# EAGLE design sumorobot (EAGLE 5.12)
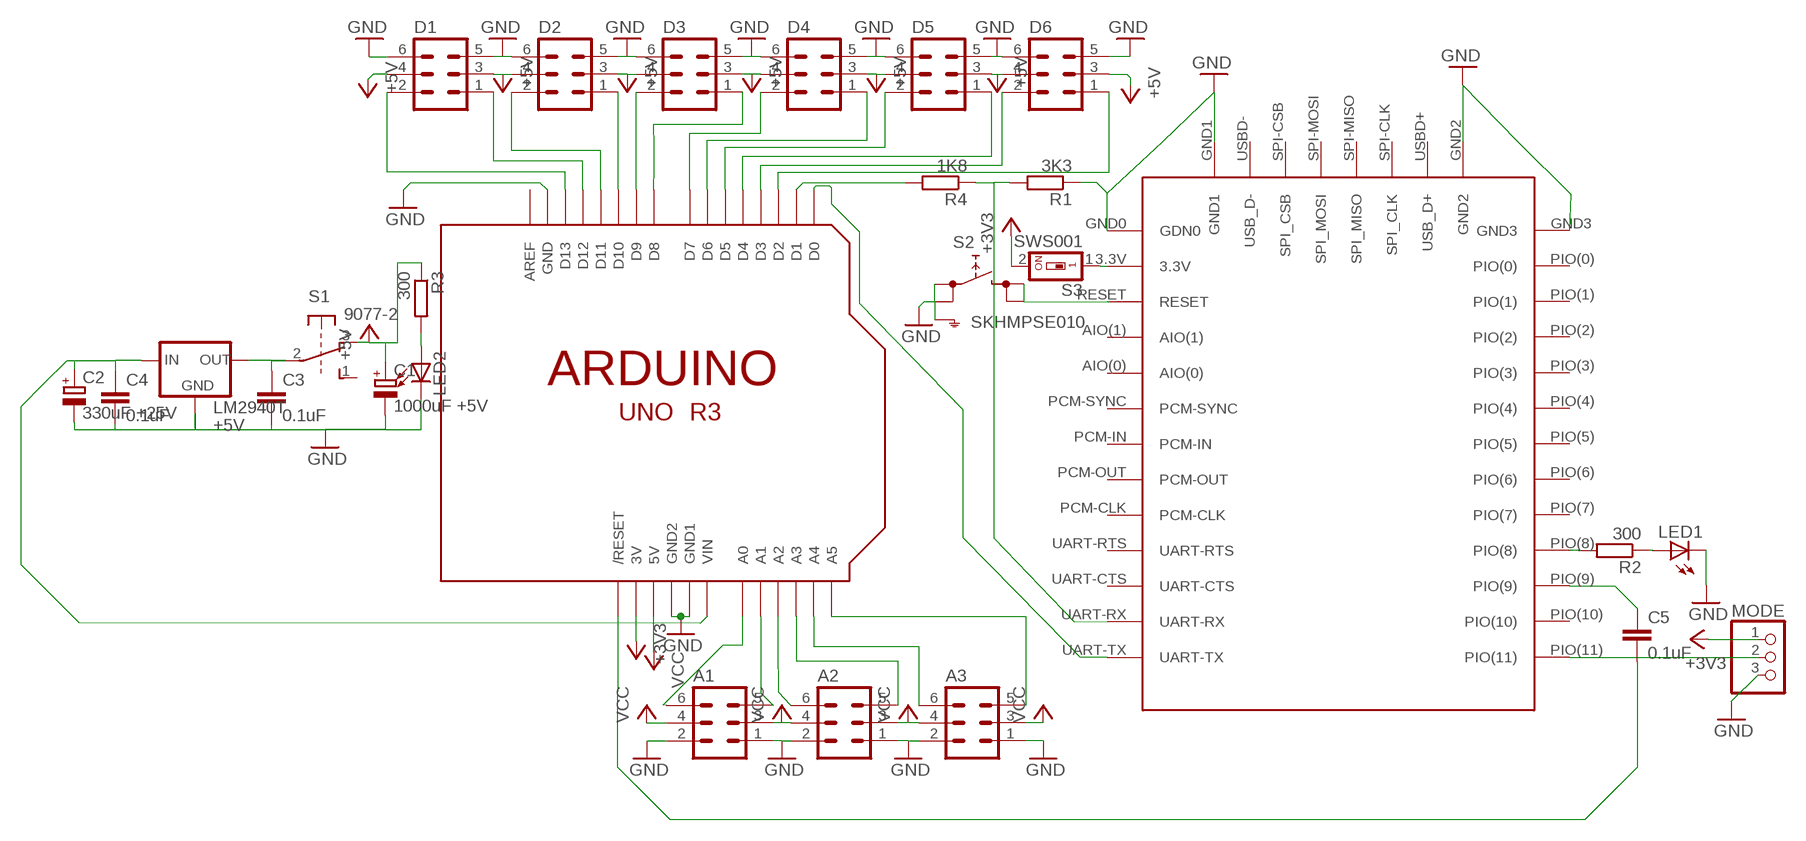
[diagram p0: schematic, sheet 1]

## Parts
A1  MA03-2  [MA03-2]
A2  MA03-2  [MA03-2]
A3  MA03-2  [MA03-2]
C1  1000uF +5V  CPOL-EUE5-10.5  [E5-10,5]
C2  330uF +25V  CPOL-EUE5-10.5  [E5-10,5]
C3  0.1uF  C-EUC1206  [C1206]
C4  0.1uF  C-EUC1206  [C1206]
C5  0.1uF  C-EUC1206  [C1206]
D1  MA03-2  [MA03-2]
D2  MA03-2  [MA03-2]
D3  MA03-2  [MA03-2]
D4  MA03-2  [MA03-2]
D5  MA03-2  [MA03-2]
D6  MA03-2  [MA03-2]
LED1  LEDSML1206  [SML1206]
LED2  LED3MM  [LED3MM]
LM2940T  +5V  78XXL  [78XXL]
MODE  PINHD-1X3  [1X03]
MODULE  SKU_80711  [SKU_80711]
R1  3K3  R-EU_R1206  [R1206]
R2  300  R-EU_R1206  [R1206]
R3  300  R-EU_R1206  [R1206]
R4  1K8  R-EU_R1206  [R1206]
S1  9077-2  [9077-2]
S2  SKHMPSE010  [SKHMPXE010]
S3  SWS001  [SMS-001]
U$1  ARDUINO-NOHOLE  [ARDUINO-NOHOLE]

## Nets
+3V3: MODE.1 S3.2 U$1.3V
+5V: C1.+ D1.3 D1.4 D2.3 D2.4 D3.3 D3.4 D4.3 D4.4 D5.3 D5.4 D6.3 D6.4 R3.1 S1.3(1:O)
D4: D4.1 U$1.D6
GND: A1.1 A1.2 A2.1 A2.2 A3.1 A3.2 C1.- C2.- C3.2 C4.2 D1.5 D1.6 D2.5 D2.6 D3.5 D3.6 D4.5 D4.6 D5.5 D5.6 D6.5 D6.6 LED1.C LED2.K(C) LM2940T.GND MODE.3 MODULE.GND0(GDN0) MODULE.GND1 MODULE.GND2 MODULE.GND3 R1.1 S2.1(1.1) S2.2(1.2) S2.5(SH) U$1.GND U$1.GND1 U$1.GND2
N$1: MODULE.UART-TX U$1.D0
N$2: A3.6 U$1.A4
N$3: LED2.A R3.2
N$4: C5.1 MODULE.PIO(9)
N$5: R4.2 U$1.D1
N$6: A3.5 U$1.A5
N$7: MODULE.RESET S2.3(2.1) S2.4(2.2)
N$8: A1.6 U$1.A0
N$9: A1.5 U$1.A1
N$10: MODULE.PIO(8) R2.2
N$11: D5.1 U$1.D4
N$12: D6.2 U$1.D3
N$13: D6.1 U$1.D2
N$14: MODULE.UART-RX R1.2 R4.1
N$15: LED1.A R2.1
N$16: C5.2 U$1.RESET(/RESET)
N$17: C3.1 LM2940T.OUT S1.2(1:P)
N$18: MODE.2 MODULE.PIO(11)
N$19: MODULE.3.3V S3.1
N$20: C2.+ C4.1 LM2940T.IN U$1.VIN
N$27: D1.2 U$1.D13
N$28: D1.1 U$1.D12
N$29: D2.2 U$1.D11
N$30: D2.1 U$1.D10
N$31: D3.2 U$1.D9
N$32: D3.1 U$1.D8
N$33: D4.2 U$1.D7
N$34: A2.6 U$1.A2
N$35: D5.2 U$1.D5
N$37: A2.5 U$1.A3
VCC: A1.3 A1.4 A2.3 A2.4 A3.3 A3.4 U$1.5V
Unconnected: MODULE.AIO(0) MODULE.AIO(1) MODULE.PCM-CLK MODULE.PCM-IN MODULE.PCM-OUT MODULE.PCM-SYNC MODULE.PIO(0) MODULE.PIO(1) MODULE.PIO(2) MODULE.PIO(3) MODULE.PIO(4) MODULE.PIO(5) MODULE.PIO(6) MODULE.PIO(7) MODULE.PIO(10) MODULE.SPI-CLK(SPI_CLK) MODULE.SPI-CSB(SPI_CSB) MODULE.SPI-MISO(SPI_MISO) MODULE.SPI-MOSI(SPI_MOSI) MODULE.UART-CTS MODULE.UART-RTS MODULE.USBD+(USB_D+) MODULE.USBD-(USB_D-) S1.1(1:S) S1.4(2:S) S1.5(2:P) S1.6(2:O) U$1.AREF

## Library data of the parts
A1-A3 D1-D6 = con-lstb:MA03-2: PIN HEADER; OC_FARNELL: unknown; OC_NEWARK: unknown
C1 C2 = rcl:CPOL-EU: POLARIZED CAPACITOR, European symbol
C3-C5 = rcl:C-EU: CAPACITOR, European symbol
LED1 LED2 = led:LED: LED OSRAM: - CHIPLED LG R971, LG N971, LY N971, LG Q971, LY Q971, LO R971, LY R971 LH N974, LH R974 LS Q976, LO Q976, LY Q976 LO Q996 - Hyper CHIPLED LW Q18S LB Q993, LB Q99A, LB R99A - SideLED LS A670, LO A670, LY A670, LG A670, LP A670 LB A673, LV A673, LT A673, LW A673 LH A674 LY A675 LS A676, LA A676, LO A676, LY A676, LW A676 LS A679, LY A679, LG A679 - Hyper Micro SIDELED® LS Y876, LA Y876, LO Y876, LY Y876 LT Y87S - SmartLED LW L88C, LW L88S LB L89C, LB L89S, LG L890 LS L89K, LO L89K, LY L89K LS L896, LA L896, LO L896, LY L896 - TOPLED LS T670, LO T670, LY T670, LG T670, LP T670 LSG T670, LSP T670, LSY T670, LOP T670, LYG T670 LG T671, LOG T671, LSG T671 LB T673, LV T673, LT T673, LW T673 LH T674 LS T676, LA T676, LO T676, LY T676, LB T676, LH T676, LSB T676, LW T676 LB T67C, LV T67C, LT T67C, LS T67K, LO T67K, LY T67K, LW E67C LS E67B, LA E67B, LO E67B, LY E67B, LB E67C, LV E67C, LT E67C LW T67C LS T679, LY T679, LG T679 LS T770, LO T770, LY T770, LG T770, LP T770 LB T773, LV T773, LT T773, LW T773 LH T774 LS E675, LA E675, LY E675, LS T675 LS T776, LA T776, LO T776, LY T776, LB T776 LHGB T686 LT T68C, LB T68C - Hyper Mini TOPLED® LB M676 - Mini TOPLED Santana® LG M470 LS M47K, LO M47K, LY M47K Source: http://www.osram.convergy.de LUXEON: - LUMILED® LXK2-PW12-R00, LXK2-PW12-S00, LXK2-PW14-U00, LXK2-PW14-V00 LXK2-PM12-R00, LXK2-PM12-S00, LXK2-PM14-U00 LXK2-PE12-Q00, LXK2-PE12-R00, LXK2-PE12-S00, LXK2-PE14-T00, LXK2-PE14-U00 LXK2-PB12-K00, LXK2-PB12-L00, LXK2-PB12-M00, LXK2-PB14-N00, LXK2-PB14-P00, LXK2-PB14-Q00 LXK2-PR12-L00, LXK2-PR12-M00, LXK2-PR14-Q00, LXK2-PR14-R00 LXK2-PD12-Q00, LXK2-PD12-R00, LXK2-PD12-S00 LXK2-PH12-R00, LXK2-PH12-S00 LXK2-PL12-P00, LXK2-PL12-Q00, LXK2-PL12-R00 Source: www.luxeon.com KINGBRIGHT: KA-3528ASYC Source: www.kingbright.com
LM2940T = v-reg:78XXL: VOLTAGE REGULATOR
MODE = pinhead:PINHD-1X3: PIN HEADER
MODULE = Bluetooth_serial:SKU_80711
R1-R4 = rcl:R-EU_: RESISTOR, European symbol
S1 = switch-misc:9077-2: MARQUARDT SWITCH 9077.0200 Distributor: Buerklin <https://www.buerklin.com/default.asp?event=ShowArtikel%2812G2822%29&l=d&jump=ArtNr_12G2822>
S2 = switch:SKHMP*E010: 6.2 X 6.5mm TACT Switch (SMD) Source: http://www3.alps.co.jp/WebObjects/catalog.woa/PDF/E/Switch/Tact/SKHM/SKHM.PDF
S3 = smd-special:SWS001: SMD Dip Switch 1 pol.
U$1 = arduino_uno:ARDUINO: Arduino Diecimila/Duemilanove Make a shield with ease, this package has all the named pins as well as the two mounting drill holes and an outline of the USB and DC power connector. The outline is on the DIMENSION layer, so if your board house uses it they will cut the outline to match. http://www.ladyada.net/library/pcb/eaglelibrary.html

## Board
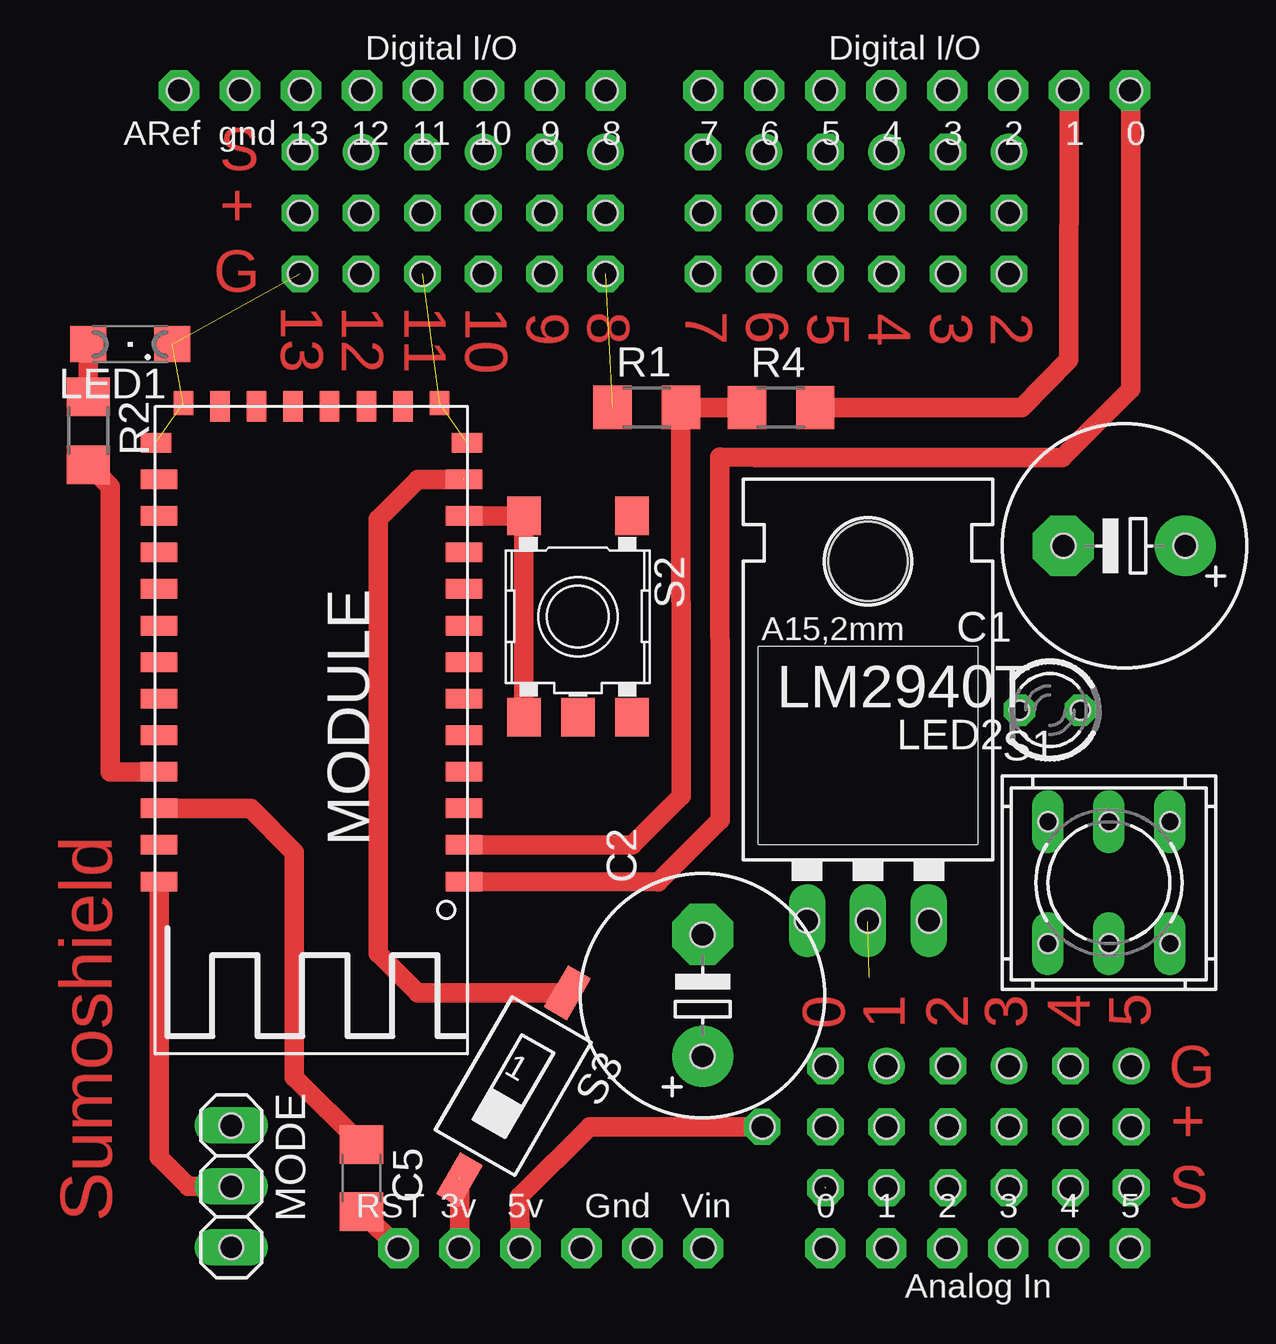
[diagram p1: board, top side]
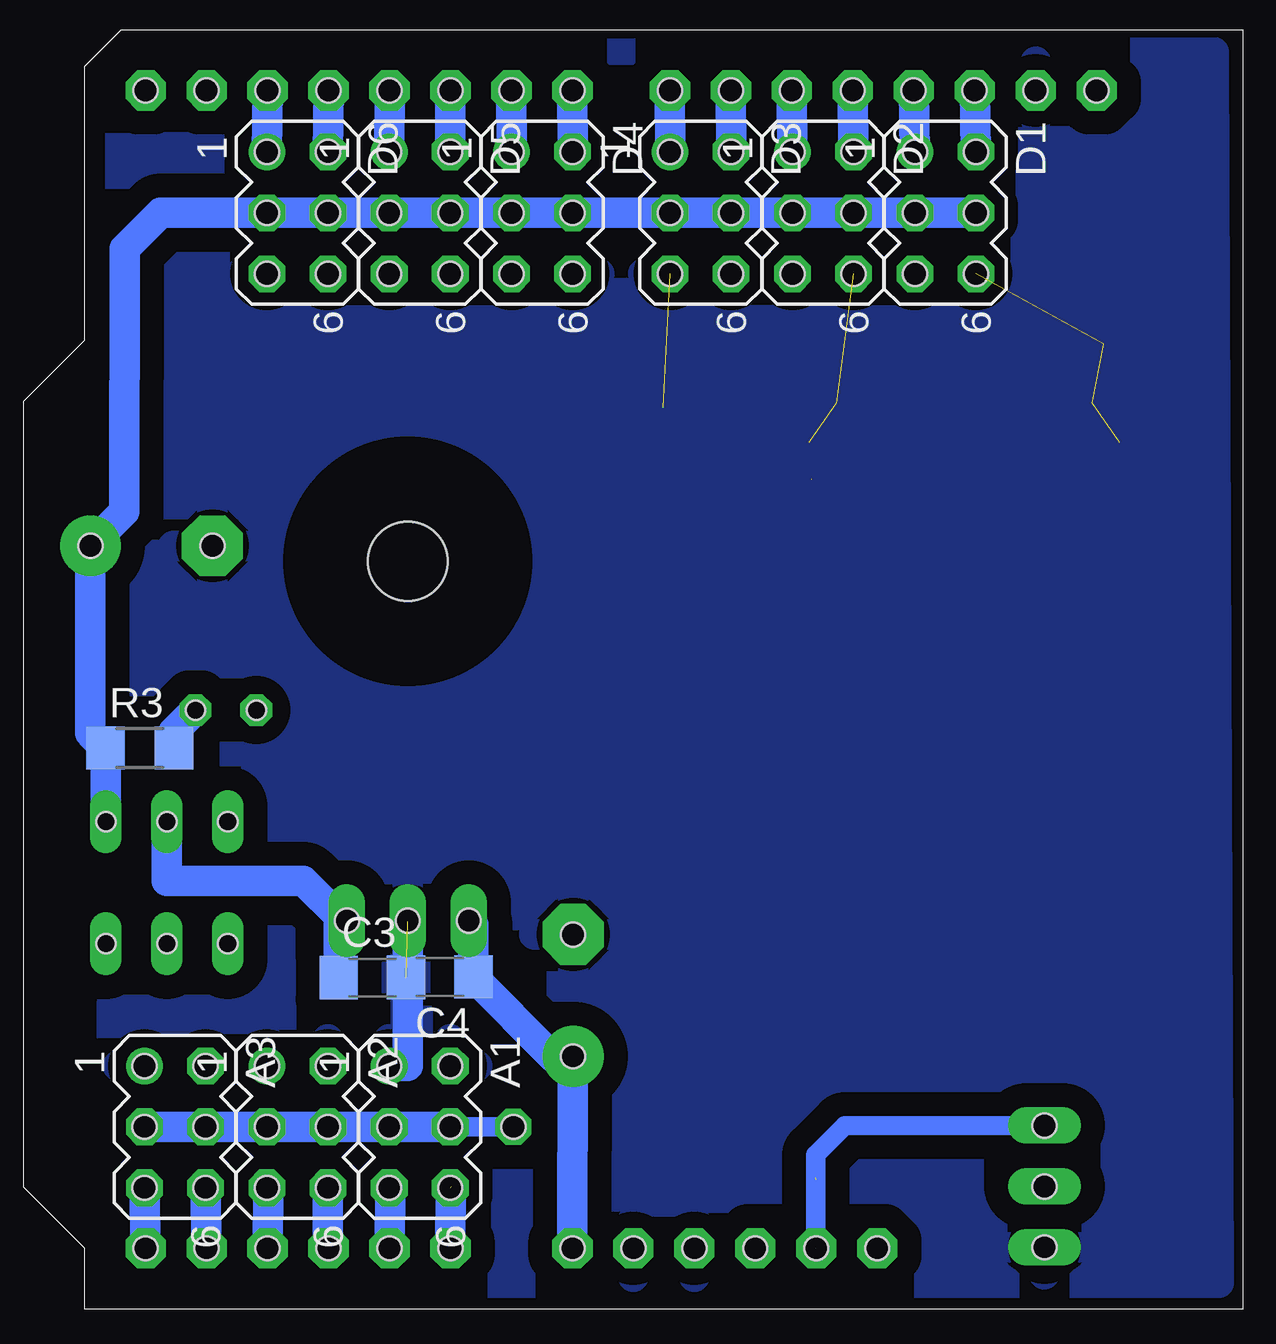
[diagram p2: board, bottom side, seen from below]

No outline drawn. Coordinates in mm, seen from the top.
Copper layers (1*16): Top 0.035mm / dielectric 1.5mm / Bottom 0.035mm
Design rules "default": minimum track width 10mil, minimum drill 24mil, track to track 8mil, track to pad 8mil, pad to pad 8mil, via to via 8mil, smd to smd 8mil, copper to edge 40mil, drill to drill 8mil, minimum pad ring 10mil, minimum via ring 8mil, stop-mask expansion 4mil, vias tented up to drill 0mil, thermal gap 10mil
Holes 1 mm at 6.1,50.8 34.8,16.19 30.4,7.6 8.27,5.12 8.27,7.66 8.27,2.58 8.64,50.8 11.18,50.8 13.72,50.8 16.26,50.8 18.8,50.8 21.34,50.8 23.87,50.8 27.94,50.8 30.48,50.8 33.02,50.8 35.56,50.8 38.1,50.8 40.64,50.8 43.18,50.8 45.72,50.8 40.67,48.24 38.13,48.24 35.57,48.24 33.03,48.24 30.47,48.24 27.93,48.24 23.87,48.24 21.33,48.24 18.77,48.24 16.23,48.24 13.67,48.24 11.13,48.24 11.13,45.7 13.67,45.7 16.23,45.7 18.77,45.7 21.33,45.7 23.87,45.7 11.13,43.16 13.67,43.16 16.23,43.16 18.77,43.16 21.33,43.16 23.87,43.16 27.93,45.7 30.47,45.7 33.03,45.7 35.57,45.7 38.13,45.7 40.67,45.7 40.67,43.16 38.13,43.16 35.57,43.16 33.03,43.16 30.47,43.16 27.93,43.16 48.02,31.82 42.94,31.82 27.91,10.54 27.91,15.62 32.26,16.19 37.34,16.19 15.24,2.54 17.78,2.54 20.32,2.54 25.4,2.54 22.86,2.54 27.94,2.54 33.02,2.54 35.56,2.54 38.1,2.54 40.64,2.54 43.18,2.54 45.72,2.54 45.77,5.06 43.23,5.06 40.67,5.06 38.13,5.06 35.57,5.06 33.03,5.06 33.03,7.6 35.57,7.6 38.13,7.6 40.67,7.6 43.23,7.6 45.77,7.6 45.77,10.14 43.23,10.14 40.67,10.14 38.13,10.14 35.57,10.14 33.03,10.14
Holes 0.8 mm at 44.84,15.24 42.3,15.24 47.38,15.24 47.38,20.32 44.84,20.32 42.3,20.32 41.11,24.97 43.65,24.97

### Footprints (pad centres in the part's own frame; a part is rotated, then mirrored left to right if it is on the bottom)
MA03-2 = drill 1.016 round: 1 -2.54,-1.27 | drill 1.016 octagon: 2 -2.54,1.27; 3 0,-1.27; 4 0,1.27; 5 2.54,-1.27; 6 2.54,1.27
E5-10,5 = drill 1.016 pad 2.54 round: + -2.54,0 | drill 1.016 pad 2.54 octagon: - 2.54,0
C1206 = smd 1.6 x 1.8: 1 -1.4,0; 2 1.4,0
SML1206 = smd 1.5 x 1.5: A 1.75,0; C -1.75,0
LED3MM = drill 0.813 octagon: A -1.27,0; K 1.27,0
78XXL = drill 1.016 long: GND 0,-3.81; IN -2.54,-3.81; OUT 2.54,-3.81 | hole 3.302: 0,11.176
1X03 = drill 1.016 long: 1 -2.54,0; 2 0,0; 3 2.54,0
SKU_80711 = smd 1.524 x 0.813: 3.3V -6.35,3.048; AIO(0) -6.35,7.62; AIO(1) -6.35,6.096; PCM-CLK -6.35,13.716; PCM-IN -6.35,10.668; PCM-OUT -6.35,12.192; PCM-SYNC -6.35,9.144; PIO(0) 6.35,3.048; PIO(1) 6.35,4.572; PIO(2) 6.35,6.096; PIO(3) 6.35,7.62; PIO(4) 6.35,9.144; PIO(5) 6.35,10.668; PIO(6) 6.35,12.192; PIO(7) 6.35,13.716; PIO(8) 6.35,15.24; PIO(9) 6.35,16.764; PIO(10) 6.35,18.288; PIO(11) 6.35,19.812; RESET -6.35,4.572; UART-CTS -6.35,16.764; UART-RTS -6.35,15.24; UART-RX -6.35,18.288; UART-TX -6.35,19.812 | smd 1.27 x 0.813: GND0 -6.477,1.524; GND3 6.477,1.524 | smd 0.813 x 1.016: GND1 -5.334,-0.127; GND2 5.334,-0.127 | smd 0.813 x 1.27: SPI-CLK 2.286,0; SPI-CSB -2.286,0; SPI-MISO 0.762,0; SPI-MOSI -0.762,0; USBD+ 3.81,0; USBD- -3.81,0
R1206 = smd 1.6 x 1.803: 1 -1.422,0; 2 1.422,0
9077-2 = drill 0.813 long: 1 -2.54,2.54; 2 0,2.54; 3 2.54,2.54; 4 -2.54,-2.54; 5 0,-2.54; 6 2.54,-2.54
SKHMPXE010 = smd 1.6 x 1.4: 1 -4.2,2.25; 2 4.2,2.25; 3 -4.2,-2.25; 4 4.2,-2.25; 5 4.2,0
SMS-001 = smd 1.092 x 2.007: 1 0,-4.496; 2 0,4.496
ARDUINO-NOHOLE = drill 1 pad 1.676 octagon: 3V 17.78,2.54; 5V 20.32,2.54; A0 33.02,2.54; A1 35.56,2.54; A2 38.1,2.54; A3 40.64,2.54; A4 43.18,2.54; A5 45.72,2.54; AREF 6.096,50.8; D0 45.72,50.8; D1 43.18,50.8; D2 40.64,50.8; D3 38.1,50.8; D4 35.56,50.8; D5 33.02,50.8; D6 30.48,50.8; D7 27.94,50.8; D8 23.876,50.8; D9 21.336,50.8; D10 18.796,50.8; D11 16.256,50.8; D12 13.716,50.8; D13 11.176,50.8; GND 8.636,50.8; GND1 25.4,2.54; GND2 22.86,2.54; RESET 15.24,2.54; VIN 27.94,2.54

### Placement (x,y rotation side)
A1  34.3,7.6 270 bottom
A2  39.4,7.6 270 bottom
A3  44.5,7.6 270 bottom
C1  45.48,31.82 180 top
C2  27.91,13.08 90 top
C3  36.27,13.82 0 bottom
C4  33.46,13.85 180 bottom
C5  13.7,5.47 270 top
D1  12.4,45.7 270 bottom
D2  17.5,45.7 270 bottom
D3  22.6,45.7 270 bottom
D4  29.2,45.7 270 bottom
D5  34.3,45.7 270 bottom
D6  39.4,45.7 270 bottom
LED1  4.06,40.22 180 top
LED2  42.38,24.97 180 top
LM2940T  34.8,20 0 top
MODE  8.27,5.12 270 top
MODULE  11.61,37.64 180 top
R1  25.58,37.59 0 top
R2  2.31,36.61 270 top
R3  45.97,23.39 0 bottom
R4  31.18,37.58 0 top
S1  44.84,17.78 0 top
S2  22.71,28.87 270 top
S3  20.03,9.3 150 top
U$1  0,0 0 top

### Tracks (layer width: path | path; a pad name or v marks a point on that pad's centre or on a via)
+3V3  (2 unrouted)
  Top 0.813: U$1.3V 17.8,2.54 17.8,5.48
  Bottom 0.813: MODE.1 16.6,7.64 17.8,6.43 17.8,2.54
+5V
  Bottom 1.27: D1.4 D1.3 D2.4 D2.3 D3.4 D3.3 D4.4 D4.3 D5.4 D5.3 D6.4 D6.3 45.1,45.7 46.6,44.2 46.61,33.24 C1.+ 48.02,24.02 R3.1 S1.3
D4
  Bottom 1.27: D4.1 U$1.D6
GND  (8 unrouted)
  Bottom 1.27: A1.1 34.8,10.14 34.8,16.17
  pour Bottom (isolate 1): 1.21,52.39 1,1.1 47.23,1.11 46.73,52.29
N$1
  Top 0.813: MODULE.UART-TX 26.07,17.82 28.65,20.39 28.63,35.51 30.11,35.49 42.89,35.49 45.75,38.35 45.75,50.75 U$1.D0
N$2
  Bottom 1.27: A3.6 U$1.A4
N$3
  Bottom 1.27: R3.2 44.55,24.07 LED2.A
N$4
  Top 0.813: MODULE.PIO(9) 9.07,20.88 10.9,19.04 10.9,9.67 C5.1
N$5
  Top 0.813: R4.2 41.21,37.58 43.16,39.59 U$1.D1
N$6
  Bottom 1.27: A3.5 U$1.A5
N$7
  Top 0.813: S2.4 S2.3 MODULE.RESET
N$8  (1 unrouted)
  Bottom 1.27: U$1.A0 33,5.1
N$9
  Bottom 1.27: A1.5 35.54,5.06 U$1.A1
N$10
  Top 0.813: R2.2 3.22,34.3 3.22,22.4 MODULE.PIO(8)
N$11
  Bottom 1.27: D5.1 U$1.D4
N$12
  Bottom 1.27: D6.2 U$1.D3
N$13
  Bottom 1.27: D6.1 U$1.D2
N$14
  Top 0.813: MODULE.UART-RX 24.97,19.34 27.02,21.4 R1.2 R4.1
N$15
  Top 0.813: R2.1 LED1.A
N$16
  Top 0.813: C5.2 U$1.RESET
N$17
  Bottom 1.27: C3.1 37.67,15.96 | 37.67,15.96 37.37,16.27 | 37.37,16.27 37.35,16.28 | 37.4,16.3 LM2940T.OUT 37.4,16.27 37.37,16.27 | 37.67,15.96 37.67,16.23 37.6,16.3 39.16,17.85 44.84,17.85 S1.2
N$18
  Top 0.813: MODULE.PIO(11) 5.26,6.33 6.47,5.12 MODE.2
N$19  (1 unrouted)
  Top 0.813: S3.1 16.03,13.19 14.39,14.83 14.39,32.94 16.04,34.59 MODULE.3.3V
N$20
  Bottom 1.27: U$1.VIN 27.92,10.58 C2.+ 28.75,10.53 C4.1 32.06,16.03 32.1,16.03 LM2940T.IN
N$27
  Bottom 1.27: D1.2 U$1.D13
N$28
  Bottom 1.27: D1.1 U$1.D12
N$29
  Bottom 1.27: D2.2 U$1.D11
N$30
  Bottom 1.27: D2.1 U$1.D10
N$31
  Bottom 1.27: D3.2 U$1.D9
N$32
  Bottom 1.27: D3.1 U$1.D8
N$33
  Bottom 1.27: D4.2 U$1.D7
N$34
  Bottom 1.27: U$1.A2 38.13,2.54 A2.6
N$35
  Bottom 1.27: D5.2 U$1.D5
N$37
  Bottom 1.27: A2.5 40.62,5.06 U$1.A3
VCC  (via drill 1)
  Top 0.813: U$1.5V 20.3,4.7 23.2,7.6 v30.4,7.6
  Bottom 0.813: v30.4,7.6 A1.4
  Bottom 1.27: A1.4 A1.3 A2.4 A2.3 A3.4 A3.3

### Text on the board
Top: S | + | G | 13 | 12 | 11 | 10 | 9 | 8 | 7 | 6 | 5 | 4 | 3 | 2 | Sumoshield | 0 | 1 | 2 | 3 | 4 | 5 | G | + | S